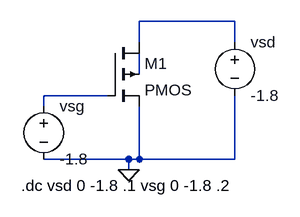
[diagram p0: schematic exp1_PMOS.asc]
exp1_PMOS.asc, the LTspice schematic file:
Version 4
SHEET 1 880 680
WIRE 368 64 224 64
WIRE 224 96 224 64
WIRE 368 96 368 64
WIRE 224 144 224 112
WIRE 176 176 80 176
WIRE 80 192 80 176
WIRE 208 272 80 272
WIRE 224 272 224 192
WIRE 224 272 208 272
WIRE 368 272 368 176
WIRE 368 272 224 272
WIRE 208 288 208 272
FLAG 208 288 0
SYMBOL pmos4 176 96 R0
SYMATTR InstName M1
SYMATTR Value2 l=180nm w=810nm
SYMBOL voltage 368 80 R0
WINDOW 123 0 0 Left 0
WINDOW 39 0 0 Left 0
SYMATTR InstName vsd
SYMATTR Value -1.8
SYMBOL voltage 80 176 R0
WINDOW 123 0 0 Left 0
WINDOW 39 0 0 Left 0
SYMATTR InstName vsg
SYMATTR Value -1.8
TEXT 46 312 Left 2 !.dc vsd 0 -1.8 .1 vsg 0 -1.8 .2

The netlist it stands for:
* exp1_PMOS.asc
M1 N001 N003 0 N002 PMOS l=180nm w=810nm
vsd N001 0 -1.8
vsg N003 0 -1.8
.model NMOS NMOS
.model PMOS PMOS
.lib standard.mos
.dc vsd 0 -1.8 .1 vsg 0 -1.8 .2
.backanno
.end